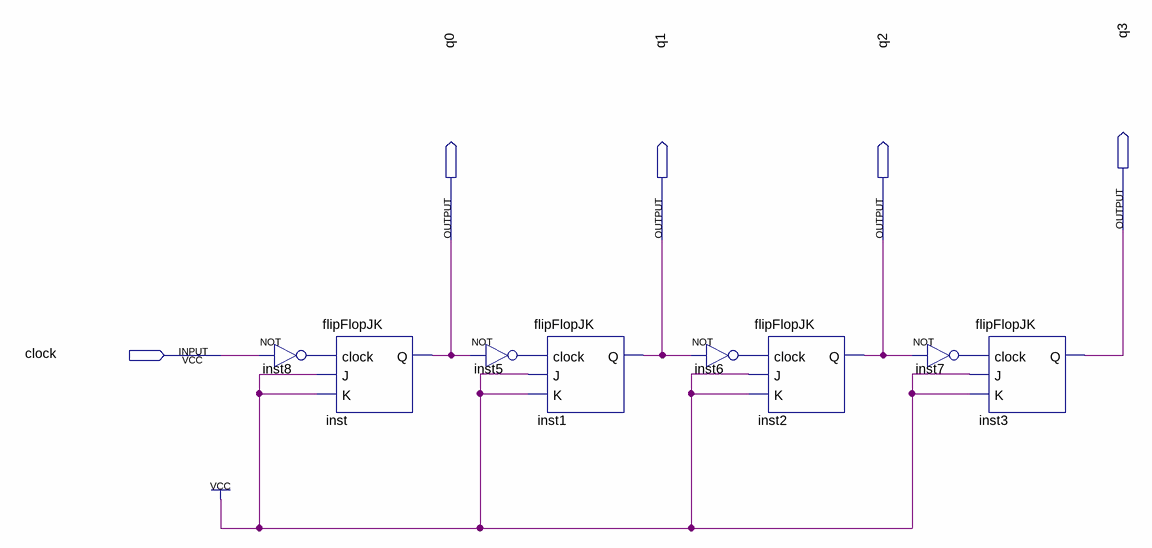
[diagram p0: schematic sheet]
// Quartus schematic contadorAsync.bdf as structural Verilog: 8 symbols, 5 pins
module contadorAsync (
  input  clock,
  output q3,
  output q0,
  output q1,
  output q2
);

  wire inst5_out, inst6_out, inst7_out, inst8_out;

  not inst8 (inst8_out, clock);
  flipFlopJK inst (.clock(inst8_out), .J(1'b1), .K(1'b1), .Q(q0));
  not inst5 (inst5_out, q0);
  flipFlopJK inst1 (.clock(inst5_out), .J(1'b1), .K(1'b1), .Q(q1));
  not inst6 (inst6_out, q1);
  flipFlopJK inst2 (.clock(inst6_out), .J(1'b1), .K(1'b1), .Q(q2));
  not inst7 (inst7_out, q2);
  flipFlopJK inst3 (.clock(inst7_out), .J(1'b1), .K(1'b1), .Q(q3));
endmodule
